# Altium schematic sheet DSO_Power.SchDoc: Schematic_Name
size A4; CompanyName: University of Melbourne; Engineer: Your Name Here; DocumentNumber: 1; Revision: 0.1; SheetNumber: 1; SheetTotal: 1; Title_Project: Project_Title; StudentNo: Student No.
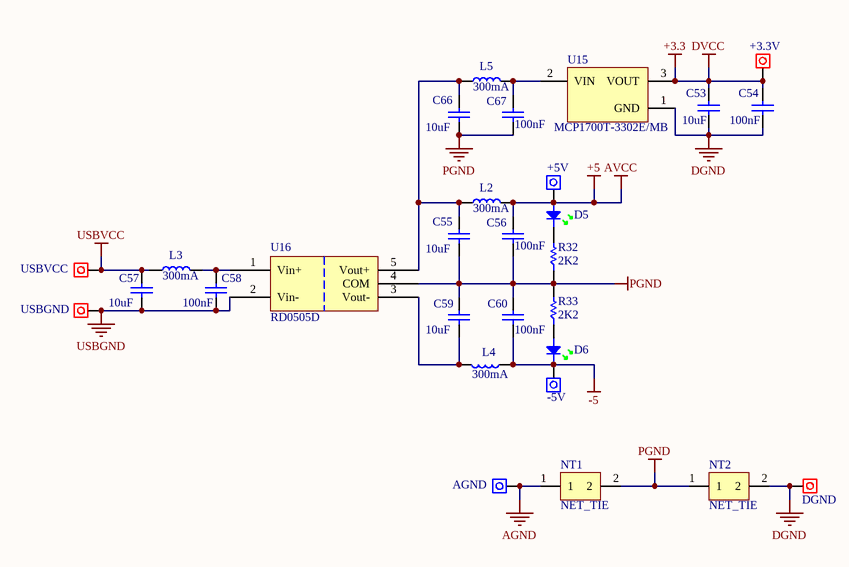
[diagram p0: DSO_Power.SchDoc]

## Parts
C53  10uF  [0805C]
C54  100nF  [0805C]
C55  10uF  [0805C]
C56  100nF  [0805C]
C57  10uF  [0805C]
C58  100nF  [0805C]
C59  10uF  [0805C]
C60  100nF  [0805C]
C66  10uF  [0805C]
C67  100nF  [0805C]
D5  +5V  [0805D-GREEN]  (value not drawn)
D6  -5V  [0805D-GREEN]  (value not drawn)
L2  300mA  [0805]
L3  300mA  [0805]
L4  300mA  [0805]
L5  300mA  [0805]
NT1  NET_TIE  [NET_TIE]  (net tie, no BOM)
NT2  NET_TIE  [NET_TIE]  (net tie, no BOM)
R32  2K2  [0805]
R33  2K2  [0805]
TP4  +3.3V  [Testpoin]  (no BOM)
TP5  DGND  [Testpoin]  (no BOM)
TP6  +5V  [PIN 1.8mm]  (no BOM)
TP8  USBVCC  [Testpoin]  (no BOM)
TP9  USBGND  [Testpoin]  (no BOM)
TP10  -5V  [PIN 1.8mm]  (no BOM)
TP11  AGND  [PIN 1.8mm]  (no BOM)
U15  MCP1700T-3302E/MB  [SOT89]
U16  RD0505D  [SIP_NMG]

## Nets
+3.3: C53.1 C54.1 TP4.1 U15.3(VOUT)  [also labelled DVCC]
+5: C56.1 D5.A L2.2 TP6.1  [also labelled AVCC]
-5: C60.1 D6.K L4.1 TP10.1
AGND: NT1.1 TP11.1
DGND: C53.2 C54.2 NT2.2 TP5.1 U15.1(GND)
PGND: C55.2 C56.2 C59.2 C60.2 C66.2 C67.2 NT1.2 NT2.1 R32.1 R33.2 U16.4(COM)
USBGND: C57.2 C58.2 TP9.1 U16.2(Vin-)
USBVCC: C57.1 L3.1 TP8.1
NetC55_1: C55.1 C66.1 L2.1 L5.1 U16.5(Vout+)
NetC58_1: C58.1 L3.2 U16.1(Vin+)
NetC59_1: C59.1 L4.2 U16.3(Vout-)
NetC67_1: C67.1 L5.2 U15.2(VIN)
NetD5_K: D5.K R32.2
NetD6_A: D6.A R33.1

## Library data of the parts
C53-C60 C66 C67 = C: Capacitor; Reviewed by: RM - 2018/08/05; Revision: July-2002: Re-released for DXP Platform.; Supplier 1: *; Supplier Part Number 1: *
  C53 C55 C57 C59 C66: Value: 10uF
  C54 C56 C58 C60 C67: Value: 100nF
D5 D6 = LED GREEN: Light Emitting Diode; Reviewed by: RM - 2018/08/05; Revision: July-2002: Re-released for DXP Platform.; Supplier 1: Digi-Key; Supplier Part Number 1: 160-1423-1-ND
L2-L5 = I: Inductor; Reviewed by: RM - 2018/08/05; Supplier 1: *; Supplier Part Number 1: *; Value: 300mA
NT1 NT2 = NET_TIE: Net Tie
R32 R33 = R: Resistor; Reviewed by: RM - 2018/08/05; Supplier 1: *; Suppler Part Number 1: *; Value: 2K2
TP4 TP5 TP8 TP9 = Test Point: Pad
  TP4: Value: +3.3V
  TP5: Value: DGND
  TP8: Value: USBVCC
  TP9: Value: USBGND
TP6 TP10 TP11 = WIRE: Pad
U15 = MCP1700T: Low Quiescent Current LDO, 3-Pin SOT-89, Extended Temperature, Tape and Reel; Reviewed by: RM - 2018/08/05; Supplier 1: Digi-Key; Supplier Part Number 1: MCP1700T3302EMBCT-ND
U16 = RD0505D: (ADV) DC to DC converter 5V in +-5V out; Reviewed by: RM - 2018/08/05; Supplier Part Number 1: 945-1136-ND; Supplier 1: Digi-Key